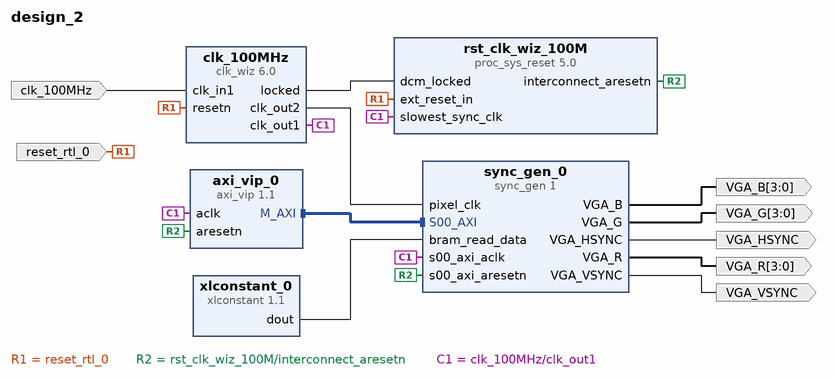
[diagram p0: block diagram of the top level]
# Vivado block design design_2, xc7a100tcsg324-1, Vivado 2018.3
create_bd_design design_2

create_bd_port -dir I -type rst reset_rtl_0
set_property -dict {CONFIG.POLARITY ACTIVE_LOW} [get_bd_ports reset_rtl_0]
create_bd_port -dir I -type clk clk_100MHz
set_property -dict {CONFIG.FREQ_HZ 100000000} [get_bd_ports clk_100MHz]
create_bd_port -dir O -from 3 -to 0 VGA_R
create_bd_port -dir O -from 3 -to 0 VGA_G
create_bd_port -dir O VGA_VSYNC
create_bd_port -dir O -from 3 -to 0 VGA_B
create_bd_port -dir O VGA_HSYNC

create_bd_cell -type ip -vlnv xilinx.com:ip:axi_vip:1.1 axi_vip_0
set_property -dict [list \
  CONFIG.ADDR_WIDTH 32 \
  CONFIG.DATA_WIDTH 32 \
  CONFIG.HAS_BRESP 1 \
  CONFIG.HAS_PROT 1 \
  CONFIG.HAS_RRESP 1 \
  CONFIG.HAS_WSTRB 1 \
  CONFIG.INTERFACE_MODE MASTER \
  CONFIG.PROTOCOL AXI4LITE \
  CONFIG.READ_WRITE_MODE READ_WRITE \
] [get_bd_cells axi_vip_0]
create_bd_cell -type ip -vlnv xilinx.com:ip:clk_wiz:6.0 clk_100MHz
set_property -dict [list \
  CONFIG.CLKOUT1_DRIVES BUFG \
  CONFIG.CLKOUT1_JITTER 137.681 \
  CONFIG.CLKOUT1_PHASE_ERROR 105.461 \
  CONFIG.CLKOUT2_DRIVES BUFG \
  CONFIG.CLKOUT2_JITTER 183.467 \
  CONFIG.CLKOUT2_PHASE_ERROR 105.461 \
  CONFIG.CLKOUT2_REQUESTED_OUT_FREQ 25.175 \
  CONFIG.CLKOUT2_USED true \
  CONFIG.CLKOUT3_DRIVES BUFG \
  CONFIG.CLKOUT4_DRIVES BUFG \
  CONFIG.CLKOUT5_DRIVES BUFG \
  CONFIG.CLKOUT6_DRIVES BUFG \
  CONFIG.CLKOUT7_DRIVES BUFG \
  CONFIG.MMCM_CLKFBOUT_MULT_F 9 \
  CONFIG.MMCM_CLKOUT0_DIVIDE_F 9 \
  CONFIG.MMCM_CLKOUT1_DIVIDE 36 \
  CONFIG.MMCM_COMPENSATION ZHOLD \
  CONFIG.MMCM_DIVCLK_DIVIDE 1 \
  CONFIG.NUM_OUT_CLKS 2 \
  CONFIG.PRIMITIVE PLL \
  CONFIG.RESET_PORT resetn \
  CONFIG.RESET_TYPE ACTIVE_LOW \
] [get_bd_cells clk_100MHz]
create_bd_cell -type ip -vlnv xilinx.com:ip:proc_sys_reset:5.0 rst_clk_wiz_100M
create_bd_cell -type ip -vlnv xilinx.com:ip:xlconstant:1.1 xlconstant_0
set_property -dict {CONFIG.CONST_VAL 4294967295 CONFIG.CONST_WIDTH 32} [get_bd_cells xlconstant_0]
create_bd_cell -type ip -vlnv xilinx.com:user:sync_gen:1 sync_gen_0

# ---- connections ----

connect_bd_intf_net [get_bd_intf_pins sync_gen_0/S00_AXI] [get_bd_intf_pins axi_vip_0/M_AXI]
connect_bd_net -net clk_wiz_locked [get_bd_pins clk_100MHz/locked] [get_bd_pins rst_clk_wiz_100M/dcm_locked]
connect_bd_net -net reset_rtl_0_1 [get_bd_ports reset_rtl_0] [get_bd_pins rst_clk_wiz_100M/ext_reset_in] [get_bd_pins clk_100MHz/resetn]
connect_bd_net [get_bd_ports clk_100MHz] [get_bd_pins clk_100MHz/clk_in1]
connect_bd_net [get_bd_pins xlconstant_0/dout] [get_bd_pins sync_gen_0/bram_read_data]
connect_bd_net [get_bd_pins rst_clk_wiz_100M/interconnect_aresetn] [get_bd_pins axi_vip_0/aresetn] [get_bd_pins sync_gen_0/s00_axi_aresetn]
connect_bd_net [get_bd_pins sync_gen_0/VGA_HSYNC] [get_bd_ports VGA_HSYNC]
connect_bd_net [get_bd_pins sync_gen_0/VGA_VSYNC] [get_bd_ports VGA_VSYNC]
connect_bd_net [get_bd_pins sync_gen_0/VGA_R] [get_bd_ports VGA_R]
connect_bd_net [get_bd_pins sync_gen_0/VGA_G] [get_bd_ports VGA_G]
connect_bd_net [get_bd_pins sync_gen_0/VGA_B] [get_bd_ports VGA_B]
connect_bd_net [get_bd_pins clk_100MHz/clk_out1] \
  [get_bd_pins axi_vip_0/aclk] [get_bd_pins rst_clk_wiz_100M/slowest_sync_clk] [get_bd_pins sync_gen_0/s00_axi_aclk]
connect_bd_net [get_bd_pins clk_100MHz/clk_out2] [get_bd_pins sync_gen_0/pixel_clk]

# ---- address map ----
assign_bd_address -offset 0x44A00000 -range 64K -target_address_space [get_bd_addr_spaces axi_vip_0/Master_AXI] [get_bd_addr_segs sync_gen_0/S00_AXI/S00_AXI_reg]

validate_bd_design
save_bd_design
